# Altium schematic sheet RTC_Miscellaneous.SchDoc
size A4; SheetNumber: 24; SheetTotal: 36
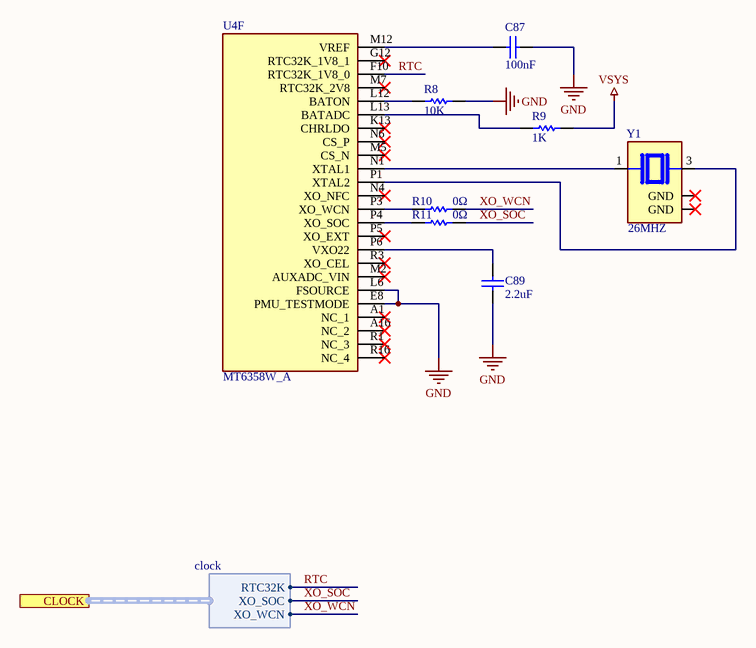
[diagram p0: RTC_Miscellaneous.SchDoc]

## Parts
C87  value 100nF  [C0603]  (hidden comment: C0603)
C89  value 2.2uF  [C0805]  (hidden comment: C0805)
R8  value 10K  [R0603]  (hidden comment: R0603)
R9  value 1K  [R0603]  (hidden comment: R0603)
R10  value 0Ω  [R0603]  (hidden comment: R0603)
R11  value 0Ω  [R0603]  (hidden comment: R0603)
U4  MT6358W_A  [BGA194C40P16X15_640X600X66]  (part F of 6)
Y1  26MHZ  [OSCCC320X250X90N]

## Ports
CLOCK (harness clock, see Power[10000,5700], MT8365[11000,4500], MT8365_Other[1500,5800], Power[11000,5700])

## Harnesses
clock: RTC32K, XO_SOC, XO_WCN

## Nets
GND: C87.1 C89.1 R8.2 U4.E8(PMU_TESTMODE) U4.L6(FSOURCE)
VSYS: R9.2
RTC: U4.F10(RTC32K_1V8_0) ; port CLOCK.RTC32K
XO_SOC: R11.2 ; port CLOCK.XO_SOC
XO_WCN: R10.2 ; port CLOCK.XO_WCN
NetC87_2: C87.2 U4.M12(VREF)
NetC89_2: C89.2 U4.P6(VXO22)
NetR8_1: R8.1 U4.L12(BATON)
NetR9_1: R9.1 U4.L13(BATADC)
NetR10_1: R10.1 U4.P3(XO_WCN)
NetR11_1: R11.1 U4.P4(XO_SOC)
NetU4_N1: U4.N1(XTAL1) Y1.1
NetU4_P1: U4.P1(XTAL2) Y1.3

Not connected (* = marked no-connect by the designer): U4 A1(NC_1)* A16(NC_2)* G12(RTC32K_1V8_1)* K13(CHRLDO)* M2(AUXADC_VIN)* M5(CS_N)* M7(RTC32K_2V8)* N4(XO_NFC)* N6(CS_P)* P5(XO_EXT)* R1(NC_3)* R3(XO_CEL)* R16(NC_4)*; Y1 2(GND)* 4(GND)*

## Library data of the parts
U4 = MT6358W_A: PMIC; Manufacturer_Name: Mediatek; Manufacturer_Part_Number: MT6358W/A; Datasheet Link: https://www.mouser.com/catalog/specsheets/MediaTek_MTK_MT6358_Product_Brief_v1_0.pdf?_gl=1*14yevt7*_ga*OTAyMjU2NDU3LjE2ODExMDUyMzk.*_ga_1KQLCYKRX3*MTcwODA1NjU3MS4xMTcuMC4xNzA4MDU2NTczLjAuMC4w*_ga_15W4STQT4T*MTcwODA1NjU3Mi4xNzIuMC4xNzA4MDU2NTczLjU5LjAuMA..; Height: 0.66mm; Mouser Part Number: 840-MT6358W/A; Mouser Price/Stock: https://www.mouser.co.uk/ProductDetail/MediaTek/MT6358W-A?qs=Jm2GQyTW%2FbiK3FZkyfX0lQ%3D%3D
Y1 = NX3225GA-26MHZ-TI